# EAGLE design BusPirate-v36 (EAGLE 6.4)

## Sheet 1 of 2
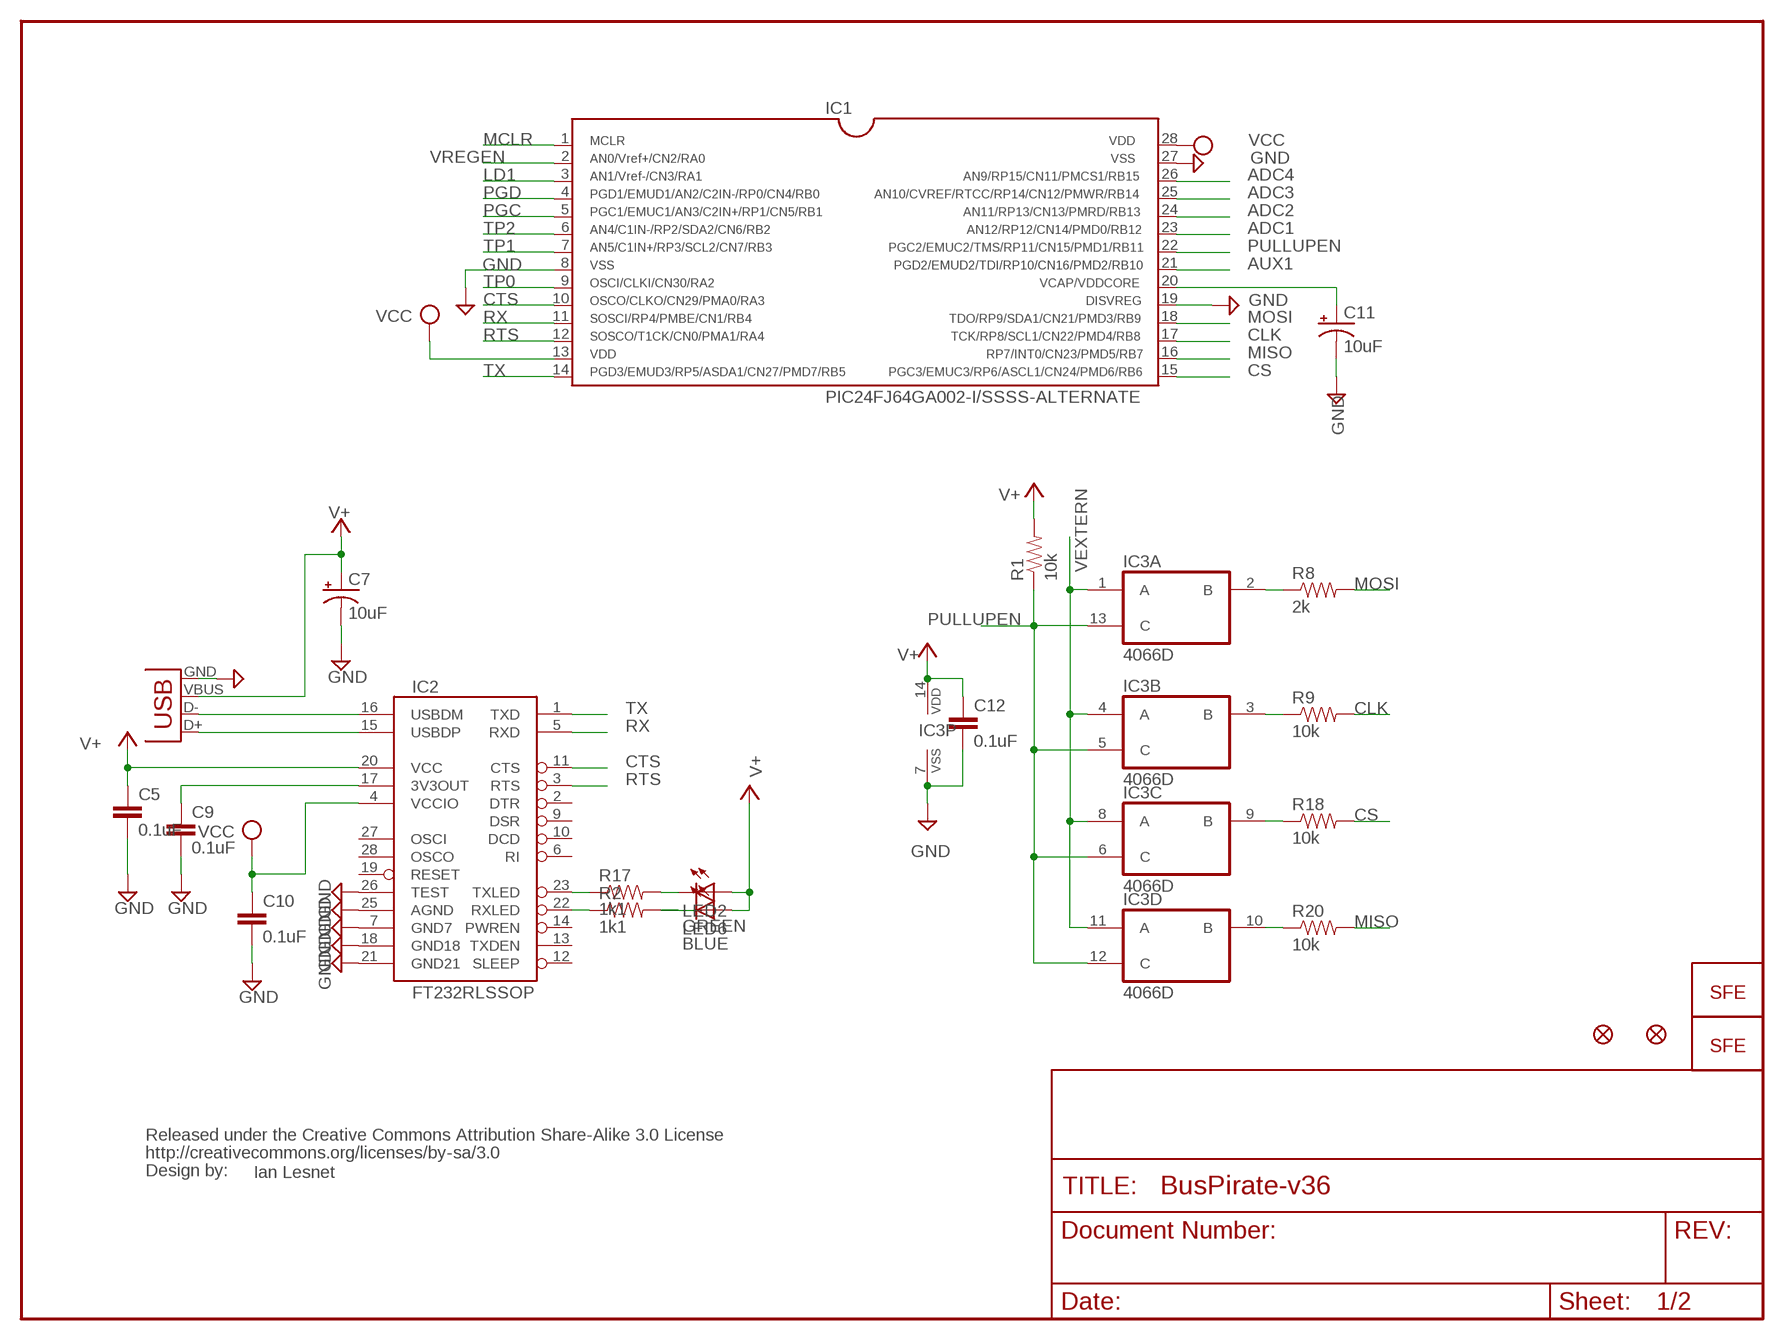
[diagram p0: schematic, sheet 1]

### Parts
C5  0.1uF  CAP0402-CAP  [0402-CAP]
C7  10uF  CAP_POL1206  [EIA3216]
C9  0.1uF  CAP0402-CAP  [0402-CAP]
C10  0.1uF  CAP0402-CAP  [0402-CAP]
C11  10uF  CAP_POL1206  [EIA3216]
C12  0.1uF  CAP0402-CAP  [0402-CAP]
IC1  PIC24FJ64GA002-I/SSSS-ALTERNATE  [SSOP28DB]
IC2  FT232RLSSOP  [SSOP28DB]
IC3  4066D  [SO14]
J1  USBSMD  [USB-MINIB]
JP1  LOGO-SFENEW  [SFE-NEW-WEBLOGO]
JP2  LOGO-SFENEW  [SFE-NEW-WEBLOGO]
JP3  FIDUCIAL1X2  [FIDUCIAL-1X2]
JP4  FIDUCIAL1X2  [FIDUCIAL-1X2]
LED2  GREEN  LED0603  [LED-0603]
LED6  BLUE  LED0603  [LED-0603]
R1  10k  RESISTOR0402-RES  [0402-RES]
R2  1k1  RESISTOR0402-RES  [0402-RES]
R8  2k  RESISTOR0402-RES  [0402-RES]
R9  10k  RESISTOR0402-RES  [0402-RES]
R17  1k1  RESISTOR0402-RES  [0402-RES]
R18  10k  RESISTOR0402-RES  [0402-RES]
R20  10k  RESISTOR0402-RES  [0402-RES]
U$2  CREATIVE_COMMONS  [CREATIVE_COMMONS]

### Nets
ADC1: IC1.23 ; also sheet 2
ADC2: IC1.24 ; also sheet 2
ADC3: IC1.25 ; also sheet 2
ADC4: IC1.26 ; also sheet 2
AUX1: IC1.21 ; also sheet 2
CLK: IC1.17 R9.2 ; also sheet 2
CS: IC1.15 R18.2 ; also sheet 2
CTS: IC1.10 IC2.11(CTS)
GND: C5.2 C7.C(-) C9.2 C10.2 C11.C(-) C12.2 IC1.8 IC1.19 IC1.27 IC2.7(GND7) IC2.18(GND18) IC2.21(GND21) IC2.25(AGND) IC2.26(TEST) IC3.7(P:VSS) J1.GND ; also sheet 2
LD1: IC1.3 ; also sheet 2
MCLR: IC1.1 ; also sheet 2
MISO: IC1.16 R20.2 ; also sheet 2
MOSI: IC1.18 R8.2 ; also sheet 2
N$1: IC3.2(A:B) R8.1
N$2: IC3.3(B:B) R9.1
N$3: C11.A(+) IC1.20
N$4: IC3.10(D:B) R20.1
N$5: IC3.9(C:B) R18.1
N$8: IC2.23(TXLED) R17.1
N$9: C9.1 IC2.17(3V3OUT)
N$10: LED2.C R17.2
N$11: IC2.22(RXLED) R2.1
N$13: LED6.C R2.2
N$15: IC2.15(USBDP) J1.D+
N$16: IC2.16(USBDM) J1.D-
PGC: IC1.5 ; also sheet 2
PGD: IC1.4 ; also sheet 2
PULLUPEN: IC1.22 IC3.5(B:C) IC3.6(C:C) IC3.12(D:C) IC3.13(A:C) R1.1
RTS: IC1.12 IC2.3(RTS)
RX: IC1.11 IC2.5(RXD)
TP0: IC1.9
TP1: IC1.7
TP2: IC1.6
TX: IC1.14 IC2.1(TXD)
V+: C5.1 C7.A(+) C12.1 IC2.20(VCC) IC3.14(P:VDD) J1.VBUS LED2.A LED6.A R1.2 ; also sheet 2
VCC: C10.1 IC1.13 IC1.28 IC2.4(VCCIO) ; also sheet 2
VEXTERN: IC3.1(A:A) IC3.4(B:A) IC3.8(C:A) IC3.11(D:A) ; also sheet 2
VREGEN: IC1.2 ; also sheet 2
Unconnected: IC2.2(DTR) IC2.6(RI) IC2.9(DSR) IC2.10(DCD) IC2.12(SLEEP) IC2.13(TXDEN) IC2.14(PWREN) IC2.19(RESET) IC2.27(OSCI) IC2.28(OSCO)

### Notes on the sheet
- Ian Lesnet

## Sheet 2 of 2
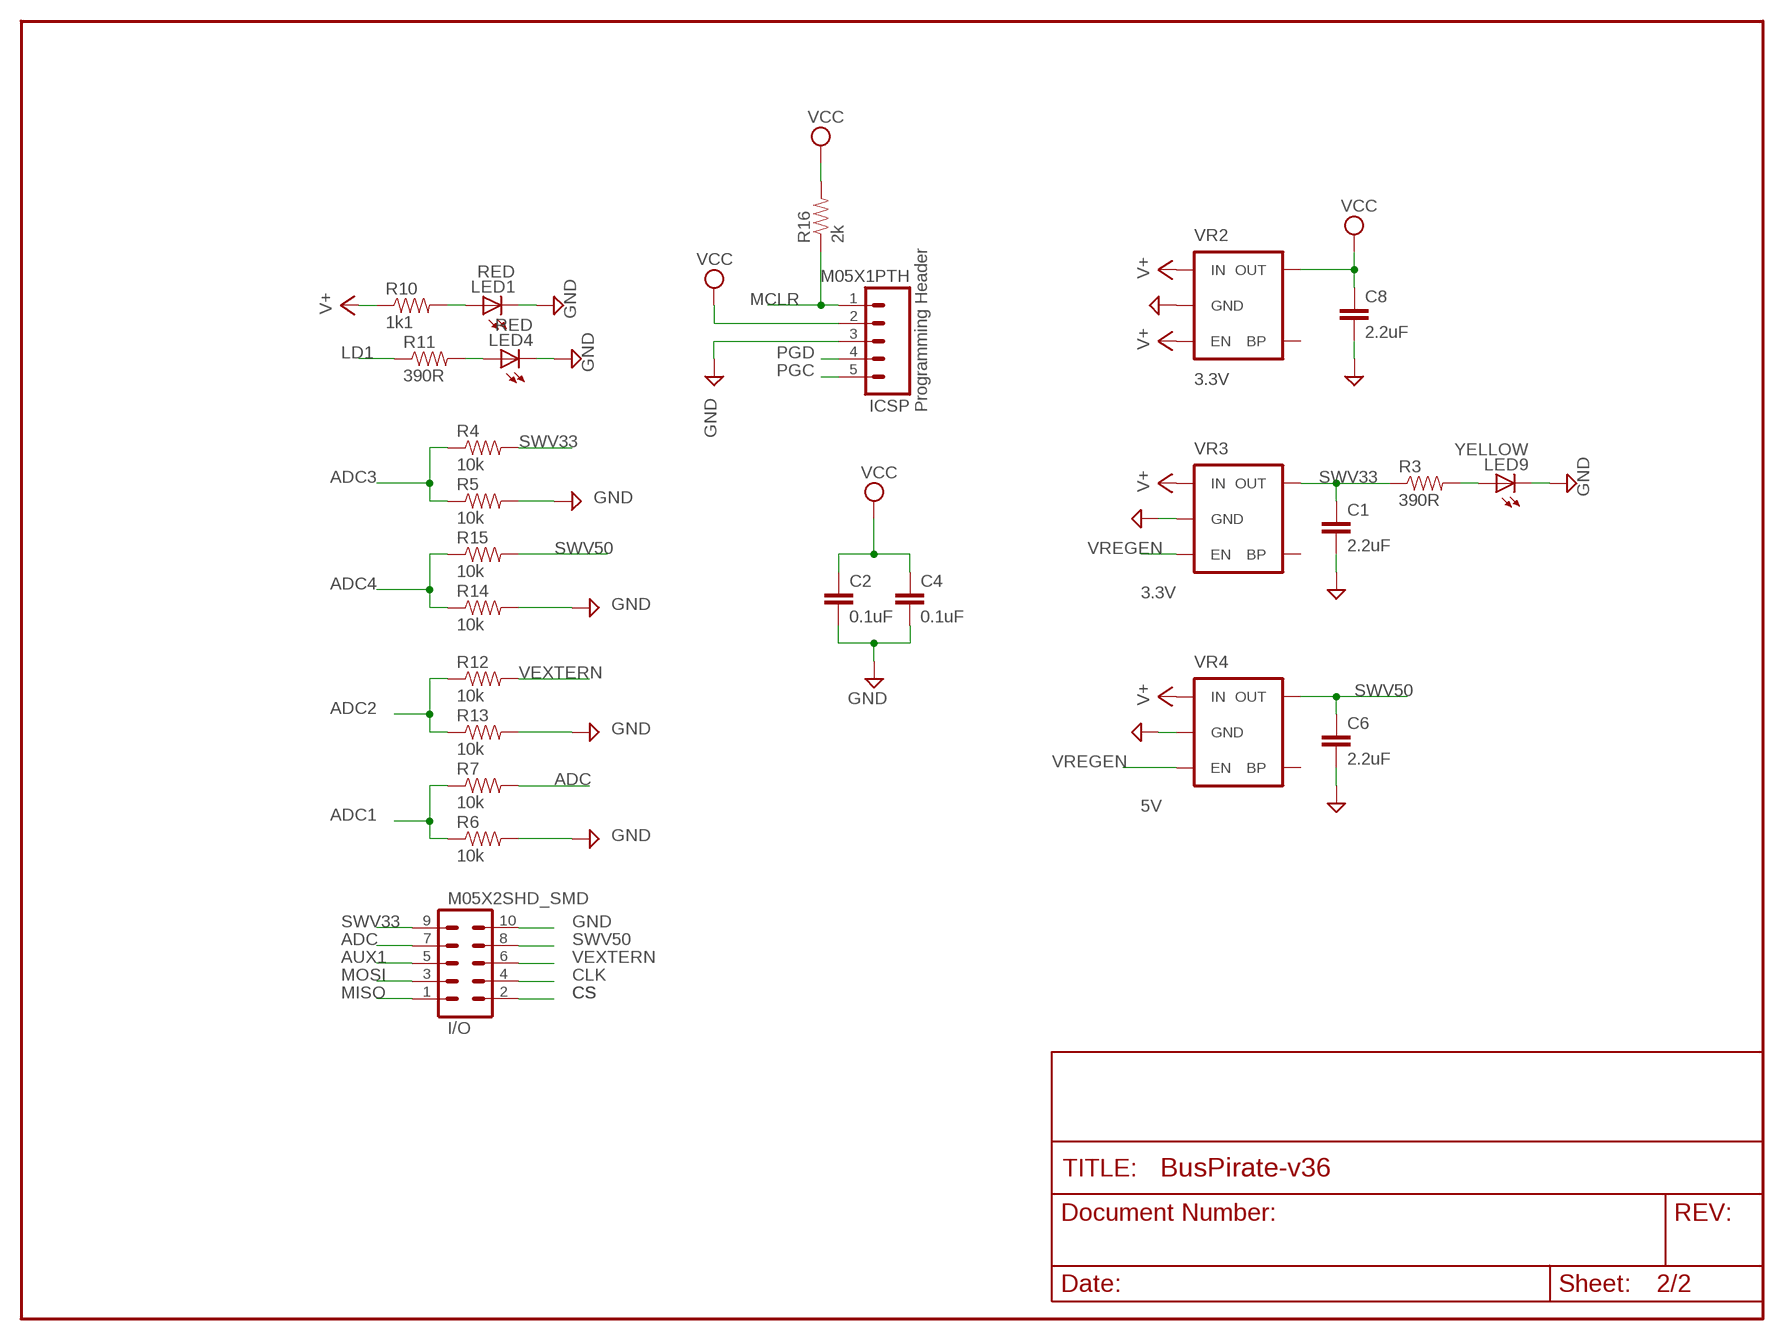
[diagram p1: schematic, sheet 2]

### Parts
C1  2.2uF  CAP0402-CAP  [0402-CAP]
C2  0.1uF  CAP0402-CAP  [0402-CAP]
C4  0.1uF  CAP0402-CAP  [0402-CAP]
C6  2.2uF  CAP0402-CAP  [0402-CAP]
C8  2.2uF  CAP0402-CAP  [0402-CAP]
I/O  M05X2SHD_SMD  [2X5-SHROUDED_SMD]
ICSP  M05X1PTH  M05PTH  [1X05]
LED1  RED  LED0603  [LED-0603]
LED4  RED  LED0603  [LED-0603]
LED9  YELLOW  LED0603  [LED-0603]
R3  390R  RESISTOR0402-RES  [0402-RES]
R4  10k  RESISTOR0402-RES  [0402-RES]
R5  10k  RESISTOR0402-RES  [0402-RES]
R6  10k  RESISTOR0402-RES  [0402-RES]
R7  10k  RESISTOR0402-RES  [0402-RES]
R10  1k1  RESISTOR0402-RES  [0402-RES]
R11  390R  RESISTOR0402-RES  [0402-RES]
R12  10k  RESISTOR0402-RES  [0402-RES]
R13  10k  RESISTOR0402-RES  [0402-RES]
R14  10k  RESISTOR0402-RES  [0402-RES]
R15  10k  RESISTOR0402-RES  [0402-RES]
R16  2k  RESISTOR0402-RES  [0402-RES]
VR2  3.3V  V_REG_LDOSMD  [SOT23-5]
VR3  3.3V  V_REG_LDOSMD  [SOT23-5]
VR4  5V  V_REG_LDOSMD  [SOT23-5]

### Nets
ADC: I/O.7 R7.2
ADC1: R6.1 R7.1 ; also sheet 1
ADC2: R12.1 R13.1 ; also sheet 1
ADC3: R4.1 R5.1 ; also sheet 1
ADC4: R14.1 R15.1 ; also sheet 1
AUX1: I/O.5 ; also sheet 1
CLK: I/O.4 ; also sheet 1
CS: I/O.2 ; also sheet 1
GND: C1.2 C2.2 C4.2 C6.2 C8.2 I/O.10 ICSP.3 LED1.C LED4.C LED9.C R5.2 R6.2 R13.2 R14.2 VR2.2(GND) VR3.2(GND) VR4.2(GND) ; also sheet 1
LD1: R11.1 ; also sheet 1
MCLR: ICSP.1 R16.1 ; also sheet 1
MISO: I/O.1 ; also sheet 1
MOSI: I/O.3 ; also sheet 1
N$6: LED4.A R11.2
N$7: LED1.A R10.2
N$18: LED9.A R3.2
PGC: ICSP.5 ; also sheet 1
PGD: ICSP.4 ; also sheet 1
SWV33: C1.1 I/O.9 R3.1 R4.2 VR3.5(OUT)
SWV50: C6.1 I/O.8 R15.2 VR4.5(OUT)
V+: R10.1 VR2.1(IN) VR2.3(EN) VR3.1(IN) VR4.1(IN) ; also sheet 1
VCC: C2.1 C4.1 C8.1 ICSP.2 R16.2 VR2.5(OUT) ; also sheet 1
VEXTERN: I/O.6 R12.2 ; also sheet 1
VREGEN: VR3.3(EN) VR4.3(EN) ; also sheet 1
Unconnected: VR2.4(BP) VR3.4(BP) VR4.4(BP)

### Notes on the sheet
- Programming Header

## Library data of the parts
C1 C2 C4-C6 C8-C10 C12 = SparkFun:CAP: Capacitor Standard 0603 ceramic capacitor, and 0.1" leaded capacitor.
C7 C11 = SparkFun:CAP_POL: Capacitor Polarized These are standard SMD and PTH capacitors. Normally 10uF, 47uF, and 100uF in electrolytic and tantalum varieties. Always verify the external diameter of the through hole cap, it varies with capacity, voltage, and manufacturer. The EIA devices should be standard.
I/O = SparkFun:M05X2: Header 5x2 Standard 10-pin dual row 0.1" header. Commonly used with AVR-ISP. Use with Spark Fun Electronics SKU: PRT-00778
IC1 = microchip-pic24:PIC24FJ64GA002-I/SS
IC2 = SparkFun:FT232RL: USB UART FT232RL 4th Generation USB UART (USB <-> Serial) Controller. Spark Fun Electronics SKU : COM-00650
IC3 = 40xx:4066: Quad bilateral ANALOG SWITCH
ICSP = SparkFun:M05: Header 5 Standard 5-pin 0.1" header. Use with straight break away headers (SKU : PRT-00116), right angle break away headers (PRT-00553), swiss pins (PRT-00743), machine pins (PRT-00117), and female headers (PRT-00115). Molex polarized connector foot print use with SKU : PRT-08230 with associated crimp pins and housings.
J1 = SparkFun:USB: USB Connectors USB-B-PTH is fully proven SKU : PRT-00139 USB-miniB is fully proven SKU : PRT-00587 USB-A-PCB is untested. USB-A-H is throughly reviewed, but untested. Spark Fun Electronics SKU : PRT-00437 USB-B-SMT is throughly reviewed, but untested. Needs silkscreen touching up. USB-A-S has not been used/tested USB-MB-H has not been used/tested
JP1 JP2 = SparkFun:LOGO-SFE: Spark Fun Electronics PCB Logo This is the standard Spark Fun Electronics PCB logo.
JP3 JP4 = SparkFun:FIDUCIAL: Fiducial Alignment Points Various fiducial points for machine vision alignment.
LED1 LED2 LED4 LED6 LED9 = SparkFun:LED: LEDs Standard schematic elements and footprints for 5mm, 3mm, 1206, and 0603 sized LEDs. 5mm - Spark Fun Electronics SKU : COM-00529 (and others)
R1-R18 R20 = SparkFun:RESISTOR: Resistor Basic schematic elements and footprints for 0603, 1206, and PTH 1/10th watt (small) resistors.
U$2 = SparkFun:CREATIVE_COMMONS
VR2-VR4 = SparkFun:V_REG_LDO: Voltage Regulator LDO Standard 150mA LDO voltage regulator in SOT-23 layout. Micrel part MIC5205. BP (by-pass) pin is used to lower output noise with 470pF cap.

## Board
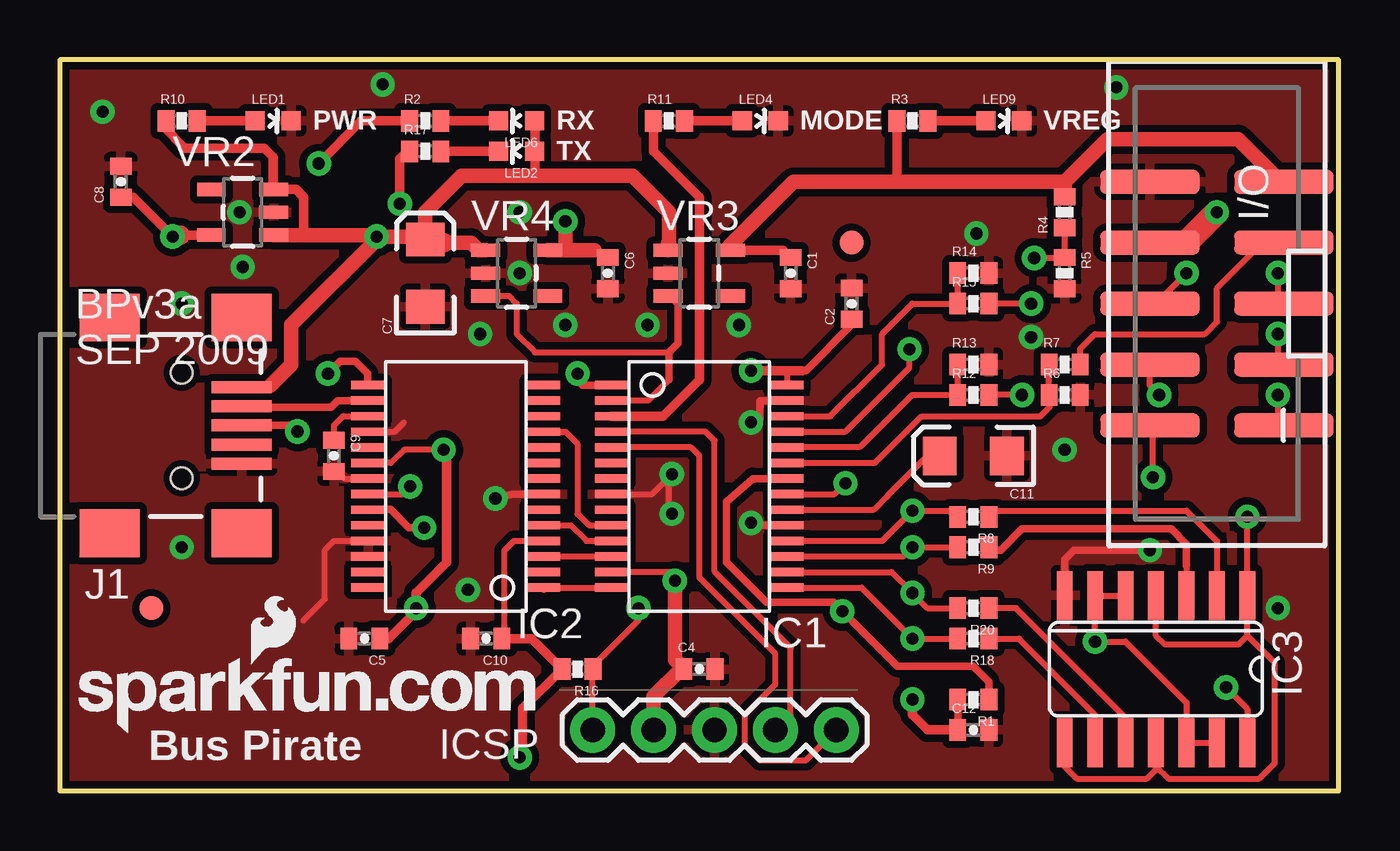
[diagram p2: board, top side]
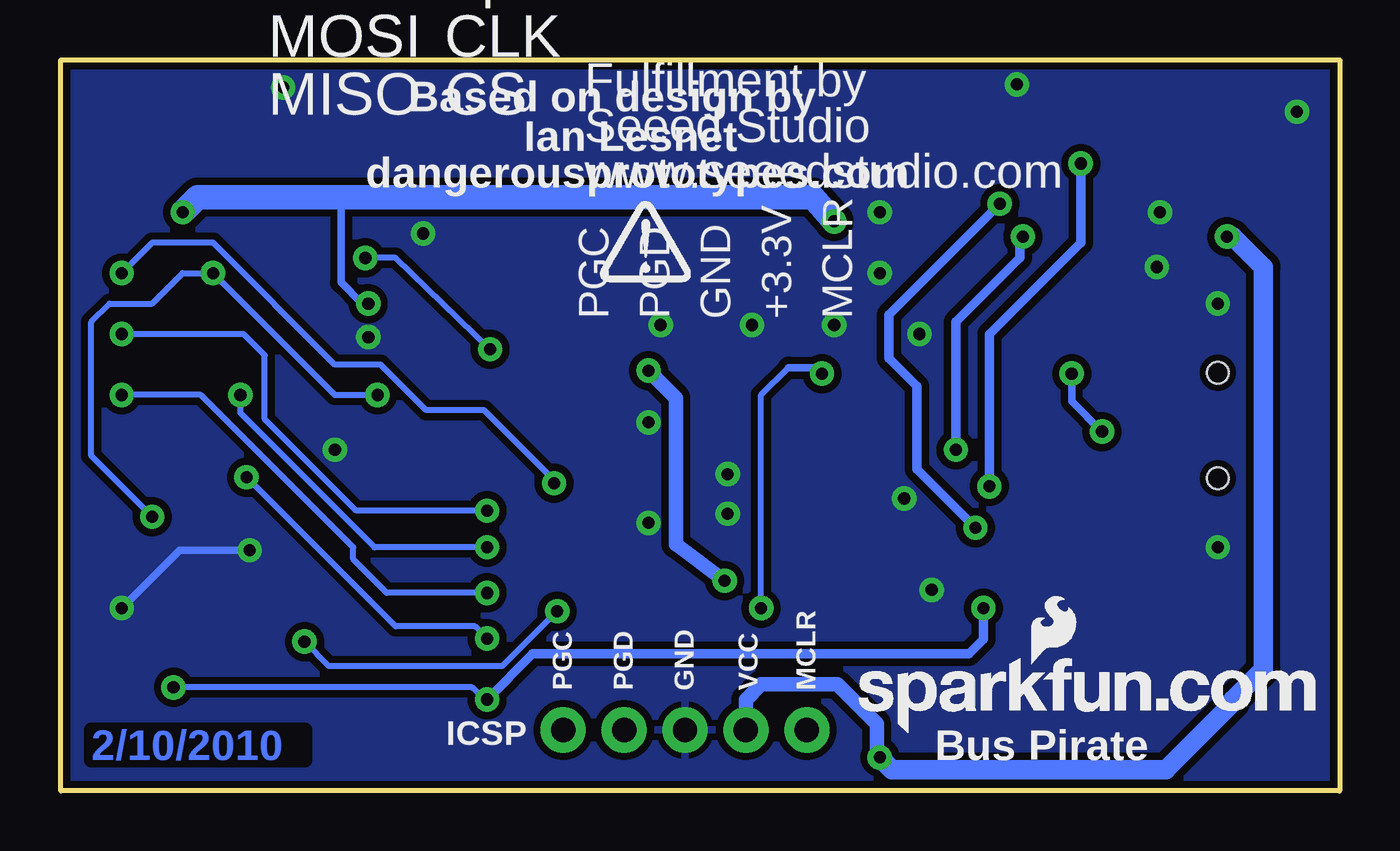
[diagram p3: board, bottom side, seen from below]

Size 53.34 x 30.48 mm. Coordinates in mm from the lower left corner, seen from the top.
Outline: 53.34,0 53.34,30.48 0,30.48 0,0 53.34,0
Copper layers (1*16): Top 0.035mm / dielectric 1.5mm / Bottom 0.035mm
Design rules "SparkFun": minimum track width 8mil, minimum drill 20mil, track to track 8mil, track to pad 8mil, pad to pad 8mil, via to via 8mil, smd to smd 8mil, copper to edge 10mil, drill to drill 8mil, minimum pad ring 12mil, minimum via ring 10mil, stop-mask expansion 4mil, vias tented up to drill 25mil, thermal gap 10mil
tRestrict: area 11.4,25.8 to 12.3,25.9

### Footprints (pad centres in the part's own frame; a part is rotated, then mirrored left to right if it is on the bottom)
0402-CAP = smd 0.7 x 0.9: 1 -0.65,0; 2 0.65,0
EIA3216 = smd 1.4 x 1.6: A 1.4,0; C -1.4,0
2X5-SHROUDED_SMD = smd 4.15 x 1: 1 -2.794,5.08; 2 2.794,5.08; 3 -2.794,2.54; 4 2.794,2.54; 5 -2.794,0; 6 2.794,0; 7 -2.794,-2.54; 8 2.794,-2.54; 9 -2.794,-5.08; 10 2.794,-5.08
SSOP28DB = smd 0.348 x 1.397: 1 -4.225,-3.656; 2 -3.575,-3.656; 3 -2.925,-3.656; 4 -2.275,-3.656; 5 -1.625,-3.656; 6 -0.975,-3.656; 7 -0.325,-3.656; 8 0.325,-3.656; 9 0.975,-3.656; 10 1.625,-3.656; 11 2.275,-3.656; 12 2.925,-3.656; 13 3.575,-3.656; 14 4.225,-3.656; 15 4.225,3.656; 16 3.575,3.656; 17 2.925,3.656; 18 2.275,3.656; 19 1.625,3.656; 20 0.975,3.656; 21 0.325,3.656; 22 -0.325,3.656; 23 -0.975,3.656; 24 -1.625,3.656; 25 -2.275,3.656; 26 -2.925,3.656; 27 -3.575,3.656; 28 -4.225,3.656
SO14 = smd 0.66 x 2.032: 1 -3.81,-3.073; 2 -2.54,-3.073; 3 -1.27,-3.073; 4 0,-3.073; 5 1.27,-3.073; 6 2.54,-3.073; 7 3.81,-3.073; 8 3.81,3.073; 9 2.54,3.073; 10 1.27,3.073; 11 0,3.073; 12 -1.27,3.073; 13 -2.54,3.073; 14 -3.81,3.073
1X05 = drill 1.016 pad 1.88: 1 0,0; 2 2.54,0; 3 5.08,0; 4 7.62,0; 5 10.16,0
USB-MINIB = smd 2.5 x 0.5: D+ 2.5,0; D- 2.5,0.8; GND 2.5,-1.6; ID 2.5,-0.8; VBUS 2.5,1.6 | smd 2.5 x 2: GND@1 -3,-4.5; GND@2 -3,4.5; GND@3 2.5,4.5; GND@4 2.5,-4.5 | hole 0.9: 0,2.2; 0,-2.2
FIDUCIAL-1X2 = smd 1 x 1: 1 0,0
LED-0603 = smd 0.8 x 0.8: A 0,-0.75; C 0,0.75
0402-RES = smd 0.7 x 0.9: 1 -0.65,0; 2 0.65,0
SOT23-5 = smd 0.55 x 1.2: 1 -0.95,-1.3; 2 0,-1.3; 3 0.95,-1.3; 4 0.95,1.3; 5 -0.95,1.3

### Placement (x,y rotation side)
C1  30.48,21.59 270 top
C2  33.02,20.32 90 top
C4  26.67,5.08 0 top
C5  12.7,6.35 180 top
C6  22.86,21.59 270 top
C7  15.24,21.59 90 top
C8  2.54,25.4 90 top
C9  11.43,13.97 270 top
C10  17.78,6.35 180 top
C11  38.1,13.97 180 top
C12  38.1,2.54 0 top
I/O  48.26,20.32 180 top
IC1  26.67,12.7 270 top
IC2  16.51,12.7 90 top
IC3  45.72,5.08 180 top
ICSP  22.23,2.54 0 top
J1  5.08,15.24 0 top
JP1  0.76,2.41 0 top
JP2  20.07,2.41 0 bottom
JP3  3.81,7.62 0 top
JP4  33.02,22.86 0 top
LED1  8.89,27.94 270 top
LED2  19.05,26.67 90 top
LED4  29.21,27.94 270 top
LED6  19.05,27.94 90 top
LED9  39.37,27.94 270 top
R1  38.1,3.81 180 top
R2  15.24,27.94 0 top
R3  35.56,27.94 0 top
R4  41.91,24.13 90 top
R5  41.91,21.59 270 top
R6  41.91,16.51 0 top
R7  41.91,17.78 0 top
R8  38.1,11.43 180 top
R9  38.1,10.16 180 top
R10  5.08,27.94 0 top
R11  25.4,27.94 0 top
R12  38.1,16.51 0 top
R13  38.1,17.78 0 top
R14  38.1,21.59 0 top
R15  38.1,20.32 0 top
R16  21.59,5.08 180 top
R17  15.24,26.67 0 top
R18  38.1,6.35 180 top
R20  38.1,7.62 180 top
U$1  [DP-LOGO]  30.86,21.21 0 bottom
U$2  -3.81,-10.16 0 top  (outside the outline)
VR2  7.62,24.13 90 top
VR3  26.67,21.59 270 top
VR4  19.05,21.59 270 top

### Tracks (layer width: path | path; a pad name or v marks a point on that pad's centre or on a via)
ADC
  Top 0.254: I/O.7 50.16,22.86 48.26,20.95 48.26,19.56 47.75,19.05 43.18,19.05 42.56,18.43 R7.2
ADC1
  Top 0.254: IC1.23 33.99,13.68 35.94,15.62 40.89,15.62 41.27,16 41.27,16.5 R6.1 R7.1
ADC2
  Top 0.203: 37.02,16.51 R12.1
  Top 0.254: 37.02,16.51 35.56,16.51 33.4,14.35 30.35,14.35 IC1.24 | R13.1 37.45,17.67 37.47,17.65 37.45,17.64 R12.1
ADC3  (via drill 0.51)
  Top 0.254: v35.43,18.41 35.43,17.65 32.77,14.99 30.34,14.99 IC1.25 | v40.64,22.23 41.9,22.23 R5.1 R4.1
  Bottom 0.254: v40.64,22.23 39.37,22.23 v35.43,18.41
ADC4
  Top 0.254: R14.1 37.45,21.48 37.47,21.46 37.45,21.45 R15.1 35.56,20.32 34.29,19.05 34.29,17.78 32.13,15.62 IC1.26
AUX1  (via drill 0.51)
  Top 0.254: IC1.21 32.31,12.38 v32.77,12.83 | v50.8,21.59 50.8,20.57 I/O.5
  Bottom 0.254: v32.77,12.83 32.77,12.95 35.69,15.88 38.1,15.88 40.01,17.78 41.91,17.78 46.99,22.86 49.53,22.86 v50.8,21.59
CLK  (via drill 0.51)
  Top 0.254: R9.2 v35.56,10.16 35.17,9.78 IC1.17 | v45.85,16.51 45.47,16.89 I/O.4
  Bottom 0.254: v35.56,10.16 40.26,10.16 45.85,15.75 v45.85,16.51
CS  (via drill 0.51)
  Top 0.254: R18.2 v35.56,6.35 33.44,8.47 IC1.15 | v45.59,13.08 45.59,15.11 I/O.2
  Bottom 0.254: v45.59,13.08 39.37,6.86 36.07,6.86 v35.56,6.35
CTS
  Top 0.254: IC2.11 21.09,14.97 21.59,14.48 21.59,11.56 22.07,11.07 IC1.10
GND  (via drill 0.51)
  Top 0.254: 25.22,12.88 25.4,12.7 25.4,11.68 v25.53,11.56 | IC2.18 13.96,14.97 14.35,15.37 | C9.2 11.54,13.32 11.56,13.34 11.87,13.03 IC2.21 | IC2.25 11.44,10.43 11.05,10.03 11.05,8 10.16,7.11 | IC1.8 24.69,12.38 v25.53,13.21
  Top 0.305: v28.83,15.37 29.21,15.49 29.21,16.26 29.23,16.27 IC1.27 | IC3.7 41.91,9.65 42.29,10.03 v45.47,10.03 | IC1.19 29.06,11.07 v28.83,11.18 | IC2.7 18.87,12.38 v18.16,12.19
  Bottom 0.305: v45.47,10.03 48.39,10.03 v50.8,7.62
  other vias: 41.91,14.22 40.51,18.92 38.23,23.24 5.08,10.16 5.08,20.32 44.07,29.34 24.51,19.43 21.08,19.43 19.18,24.13 17.53,19.05 13.46,29.46 28.32,19.43 19.18,21.59 1.78,28.32 17.02,8.38 7.49,24.13 7.62,21.84
  pour Top (isolate 0.305): 0,30.48 53.34,30.48 53.34,0 0,0
  pour Bottom (isolate 0.305): 0,30.48 53.34,30.48 53.34,0 0,0
LD1
  Top 0.406: IC1.3 25.15,15.62 26.67,17.14 26.67,24.77 24.77,26.67 24.77,27.93 R11.1
MCLR  (via drill 0.51)
  Top 0.254: ICSP.1 22.23,5.21 | 22.23,5.21 22.24,5.19 R16.1 | 22.23,5.21 24.13,7.11 v24.13,7.62
  Top 0.305: v21.59,17.4 21.59,17.14 21.81,16.93 IC1.1
  Bottom 0.254: v24.13,7.62 24.13,16.51 22.99,17.65
  Bottom 0.305: 22.99,17.65 21.84,17.65 v21.59,17.4
MISO  (via drill 0.51)
  Top 0.254: v35.56,8.26 35.45,8.36 | R20.2 36.2,7.62 v35.56,8.26 | IC1.16 34.69,9.12 v35.56,8.26 | v50.8,16.51 50.8,15.49 I/O.1
  Bottom 0.254: v35.56,8.26 39.75,8.26 41.15,9.65 41.15,10.16 47.5,16.51 v50.8,16.51
MOSI  (via drill 0.51)
  Top 0.254: R8.2 37.34,11.43 37.08,11.68 v35.56,11.68 34.3,10.43 IC1.18 | v50.8,19.05 50.8,18.03 I/O.3
  Bottom 0.254: v35.56,11.68 41.02,11.68 44.83,15.49 44.83,18.16 45.72,19.05 v50.8,19.05
N$1
  Top 0.254: R8.1 38.75,11.54 38.73,11.56 38.86,11.68 46.99,11.68 48.26,10.41 IC3.2
N$2
  Top 0.254: 46.99,9.4 IC3.3
  Top 0.305: 46.99,9.4 46.99,10.29 46.35,10.92 40.13,10.92 39.24,10.03 38.99,10.03 38.86,10.16 R9.1
N$3
  Top 0.254: 34.54,12.32 34.46,12.23 | 34.54,12.32 36.2,13.97 C11.A | IC1.20 33.95,11.72 34.54,12.32
N$4
  Top 0.254: R20.1 38.99,7.62 | IC3.10 44.45,3.05 39.88,7.62 R20.1 | R20.1 38.73,7.62
N$5
  Top 0.254: 38.73,6.48 38.75,6.46 R18.1 38.75,6.37 38.86,6.48 38.99,6.35 40.01,6.35 43.18,3.17 IC3.9
N$6
  Top 0.406: 26.04,27.94 R11.2 LED4.A
N$7
  Top 0.406: R10.2 LED1.A
N$8  (via drill 0.51)
  Top 0.305: IC2.23 13.51,11.73 13.79,11.73 14.55,10.97 v15.19,10.97
  Top 0.406: R17.1 14.48,26.67 14.17,26.36 v14.17,24.49
  Bottom 0.406: v14.17,24.49 18.8,19.86 18.8,18.03 17.63,16.87 17.63,13.41 v15.19,10.97
N$9
  Top 0.254: IC2.17 11.81,15.62 11.43,15.24 11.43,14.86 11.3,14.73 11.41,14.62 C9.1
N$10
  Top 0.406: R17.2 LED2.C
N$11  (via drill 0.51)
  Top 0.254: IC2.22 14.28,12.38 v14.61,12.7
  Top 0.406: 14.61,27.94 R2.1 12.57,27.94 v10.79,26.16
  Bottom 0.406: v14.61,12.7 14.61,19.05 10.79,22.86 v10.79,26.16
N$13
  Top 0.406: R2.2 LED6.C
N$15  (via drill 0.51)
  Top 0.305: J1.D+ 9.65,15.24 v9.91,14.99 | v11.18,17.4 11.68,17.91 12.32,17.91 12.83,17.4 12.83,16.9 | 12.83,16.9 12.83,16.89 | 12.83,16.9 IC2.15
  Bottom 0.305: v9.91,14.99 11.18,16.26 v11.18,17.4
N$16
  Top 0.305: IC2.16 11.58,16.27 11.3,16 7.75,16 7.71,16.04 J1.D-
N$18
  Top 0.406: 36.2,27.94 R3.2 LED9.A
PGC
  Top 0.254: ICSP.5 31.11,1.27 29.21,1.27 28.57,1.91 28.57,3.17 29.84,4.45 29.84,5.71 26.67,8.89 26.67,13.97 26.32,14.32 23.27,14.32 23.24,14.35 23.21,14.32 IC1.5
PGD
  Top 0.254: ICSP.4 30.48,3.17 30.48,5.97 27.3,9.14 27.3,14.61 26.93,14.97 IC1.4
PULLUPEN  (via drill 0.51)
  Top 0.254: IC3.5 44.45,8.13 43.2,8.13 | 43.2,8.13 IC3.6 | 43.2,8.13 43.18,8.1 v43.18,6.22 44.45,6.22 46.99,3.68 46.99,2.03 | 46.99,2.03 IC3.12 | IC3.13 47.02,2.01 46.99,2.03
  Top 0.305: R1.1 38.75,4.56 38.1,5.21 34.92,5.21 v32.64,7.49 32.26,7.87 29.46,7.87 27.81,9.53 27.81,12.06 28.9,13.03 IC1.22
  Bottom 0.254: v43.18,6.22 42.16,5.21 34.92,5.21 v32.64,7.49
RTS
  Top 0.254: IC2.3 IC1.12
RX
  Top 0.254: IC1.11 21.96,10.43 21.31,11.07 IC2.5
SWV33
  Top 0.254: C1.1 30.21,22.24 | 28.08,22.87 28.07,22.89 28.07,22.64 VR3.5
  Top 0.406: R3.1 34.91,25.41 34.92,25.4 | C1.1 30.48,22.23 30.16,22.54 VR3.5
  Top 0.61: I/O.9 50.8,25.53 49.15,27.18 43.69,27.18 41.91,25.4 | 27.97,22.7 27.94,22.73 28.08,22.87 30.61,25.4 34.92,25.4 41.91,25.4 | 41.91,25.4 R4.2
SWV50  (via drill 0.51)
  Top 0.254: v40.51,20.32 R15.2 | 22.23,22.54 22.23,22.61 22.59,22.24 C6.1
  Top 0.61: VR4.5 20.95,22.54 | 20.95,22.54 22.23,22.54 22.31,22.54 | v21.08,23.75 21.08,22.67 20.95,22.54
  Top 1.016: v48.26,24.13 46.99,22.86 I/O.8
  Bottom 0.305: v40.51,20.32 40.77,20.32 41.66,21.21 41.66,24.51 41.53,24.64 41.53,24.77
  Bottom 1.016: v21.08,23.75 21.97,24.77 41.53,24.77 47.62,24.77 v48.26,24.13
TX
  Top 0.254: IC2.1 20.17,8.41 20.19,8.38 20.29,8.47 IC1.14
V+  (via drill 0.51)
  Top 0.203: C7.A 16,22.86
  Top 0.254: IC3.14 49.53,3.43 v48.64,4.32 | 15.88,14.22 15.83,14.18 | IC2.20 13.8,13.68 14.35,14.22 15.75,14.22 15.88,14.35 v16,14.22 | J1.VBUS | J1.VBUS | 8.76,16.89 8.71,16.84 J1.VBUS
  Top 0.305: R1.2 37.47,3.81 37.45,3.79 C12.1
  Top 0.406: v35.56,3.81 35.56,3.17 36.2,2.54 C12.1 | 10.16,23.18 10.16,24.77 9.85,25.08 VR2.3 8.89,25.11 8.89,26.42 8.51,26.8 5.21,26.8 4.32,27.69 4.43,27.8 R10.1 | v16,14.22 15.88,14.22 | v16,14.22 15.96,14.18 | v16,14.22 16.13,14.1 16.13,9.53 14.86,8.26 v14.86,7.62 14.86,7.49 13.72,6.35 C5.1 | 21.08,25.65 21.07,25.67 | 19.81,25.65 19.81,26.66 LED2.A 19.81,26.68 19.81,27.94 LED6.A
  Top 0.61: 15.24,23.11 15.24,24.13 16.76,25.65 19.81,25.65 21.08,25.65 23.88,25.65 25.4,24.13 25.4,22.86 25.37,22.83 VR3.1 | 16,22.86 17.14,22.86 17.46,22.54 VR4.1 | VR2.1 10.16,23.18 13.14,23.18 v13.21,23.11 13.34,23.11 | 15.24,23.11 C7.A | 13.34,23.11 15.24,23.11 | 13.34,23.11 9.65,19.43 9.65,17.78 8.76,16.89
  Top 0.813: 16,22.86 15.47,22.86
  Bottom 0.254: v35.56,3.81 35.69,3.81 36.2,4.32 v48.64,4.32
  Bottom 0.406: v14.86,7.62 v14.87,7.61 14.87,6.32 15.47,5.71 33.66,5.71 v35.56,3.81 | v16,14.22 16,19.56 13.34,22.23 13.34,22.99 v13.21,23.11
VCC  (via drill 0.51)
  Top 0.254: 18.54,6.48 18.54,10.03 18.93,10.43 IC2.4 | v25.65,8.76 25.65,8.89 25.42,9.12 IC1.13 | IC1.28 30.33,17.5 30.35,17.53
  Top 0.305: 30.96,17.53 31.11,17.53 33.02,19.43 C2.1
  Top 0.406: v28.83,17.53 30.35,17.53 30.96,17.53 | C8.1 3.06,24.75 v4.7,23.11 | VR2.5 6.16,23.18 6.1,23.11 6.03,23.18 5.02,23.18 | 18.43,6.24 18.41,6.22 | 18.43,6.24 C10.1 18.54,6.35 | 18.54,6.35 18.54,6.48 | 18.54,6.35 18.43,6.24 | 18.54,6.35 19.67,6.35 R16.2 19.3,3.44 19.3,1.4 v19.18,1.4
  Top 0.61: ICSP.2 24.77,3.94 25.91,5.08 C4.1 26.04,5.08 25.65,5.46 v25.65,8.76
  Top 0.813: v4.7,23.11 5.02,23.18
  Bottom 0.61: ICSP.2 24.77,3.81 24.13,4.45 20.95,4.45 19.3,2.79 19.3,1.4 v19.18,1.4 | v25.65,8.76 27.69,10.29 27.69,16.38 v28.83,17.53
  Bottom 0.813: v4.7,23.11 4.45,23.11 3.17,21.84 3.17,5.08 4.45,3.81 4.45,3.68 7.24,0.89 18.67,0.89 v19.18,1.4
VEXTERN  (via drill 0.51)
  Top 0.203: 39.05,16.51 R12.2
  Top 0.254: v40.13,16.51 39.05,16.51 | IC3.8 41.91,1.02 42.42,0.51 45.34,0.51 45.72,0.89 IC3.11 45.72,1.02 46.23,0.51 50.04,0.51 50.67,1.14 50.67,5.33 49.53,6.48 | 49.53,6.48 49.53,7.62 IC3.1 v49.53,11.43 | 45.72,8 45.72,6.48 46.1,6.1 49.15,6.1 49.53,6.48 | 45.72,8 45.59,8.13 45.62,8.15 IC3.4 45.72,8 | v46.99,21.59 45.72,20.32 I/O.6
  Bottom 0.254: v40.13,16.51 41.91,16.51 v46.99,21.59 48.26,21.59 49.53,20.32 51.31,20.32 52.07,19.56 52.07,13.97 v49.53,11.43
VREGEN
  Top 0.254: VR4.3 18.73,20.64 19.05,20.32 19.05,19.05 19.81,18.29 25.4,18.29 | IC1.2 24.53,16.27 25.4,17.14
  Top 0.305: VR3.3 25.4,20.61 25.49,20.61 25.78,20.32 25.78,18.67 25.4,18.29 25.4,17.14

### Text on the board
Bottom: 2/10/2010
tPlace: PWR | RX | MODE | VREG | TX | Bus Pirate
bPlace: Based on design by | Ian Lesnet | dangerousprototypes.com | MCLR | VCC | GND | PGD | PGC | ICSP | Bus Pirate
tNames: BPv3a | SEP 2009
bNames: PWR | USB | MODE | VREG | GND | +3.3 | BPv3 | +5V | ADC | DangerousPrototypes.com | Vpu | AUX | CLK | MOSI | Fulfillment by | CS | MISO | Seeed Studio | www.seeedstudio.com | MCLR | +3.3V | GND | PGD | PGC
tValues: Ian Lesnet | Layout for SparkFun Electronics by Chris Taylor
Reference: GND | +3v | +5v | ADC | Vpu | AUX1 | CLK | MOSI | USB | CS | MISO | I/O header | MCLR | +3.3V | GND | DATA | CLOCK | Programming Header